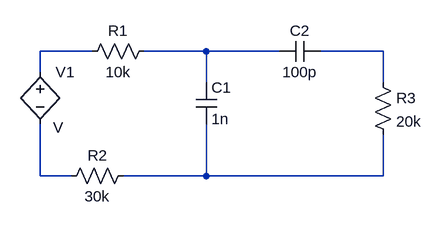
[diagram p0: schematic Draft1.asc]
Draft1.asc, the LTspice schematic file:
Version 4
SHEET 1 880 680
WIRE 16 80 -64 80
WIRE 192 80 96 80
WIRE 304 80 192 80
WIRE 464 80 368 80
WIRE -64 112 -64 80
WIRE 192 128 192 80
WIRE 464 128 464 80
WIRE -64 272 -64 192
WIRE -16 272 -64 272
WIRE 192 272 192 192
WIRE 192 272 64 272
WIRE 464 272 464 208
WIRE 464 272 192 272
SYMBOL cap 176 128 R0
SYMATTR InstName C1
SYMATTR Value 1n
SYMBOL cap 368 64 R90
WINDOW 0 0 32 VBottom 2
WINDOW 3 32 32 VTop 2
SYMATTR InstName C2
SYMATTR Value 100p
SYMBOL res 112 64 R90
WINDOW 0 0 56 VBottom 2
WINDOW 3 32 56 VTop 2
SYMATTR InstName R1
SYMATTR Value 10k
SYMBOL res 80 256 R90
WINDOW 0 0 56 VBottom 2
WINDOW 3 32 56 VTop 2
SYMATTR InstName R2
SYMATTR Value 30k
SYMBOL res 448 112 R0
SYMATTR InstName R3
SYMATTR Value 20k
SYMBOL bv -64 96 R0
WINDOW 3 20 101 Left 2
SYMATTR InstName V1
SYMATTR Value V

The netlist it stands for:
* Draft1.asc
C1 N002 N005 1n
C2 N003 N002 100p
R1 N002 N001 10k
R2 N005 N004 30k
R3 N003 N005 20k
B§V1 N001 N004 V
.backanno
.end